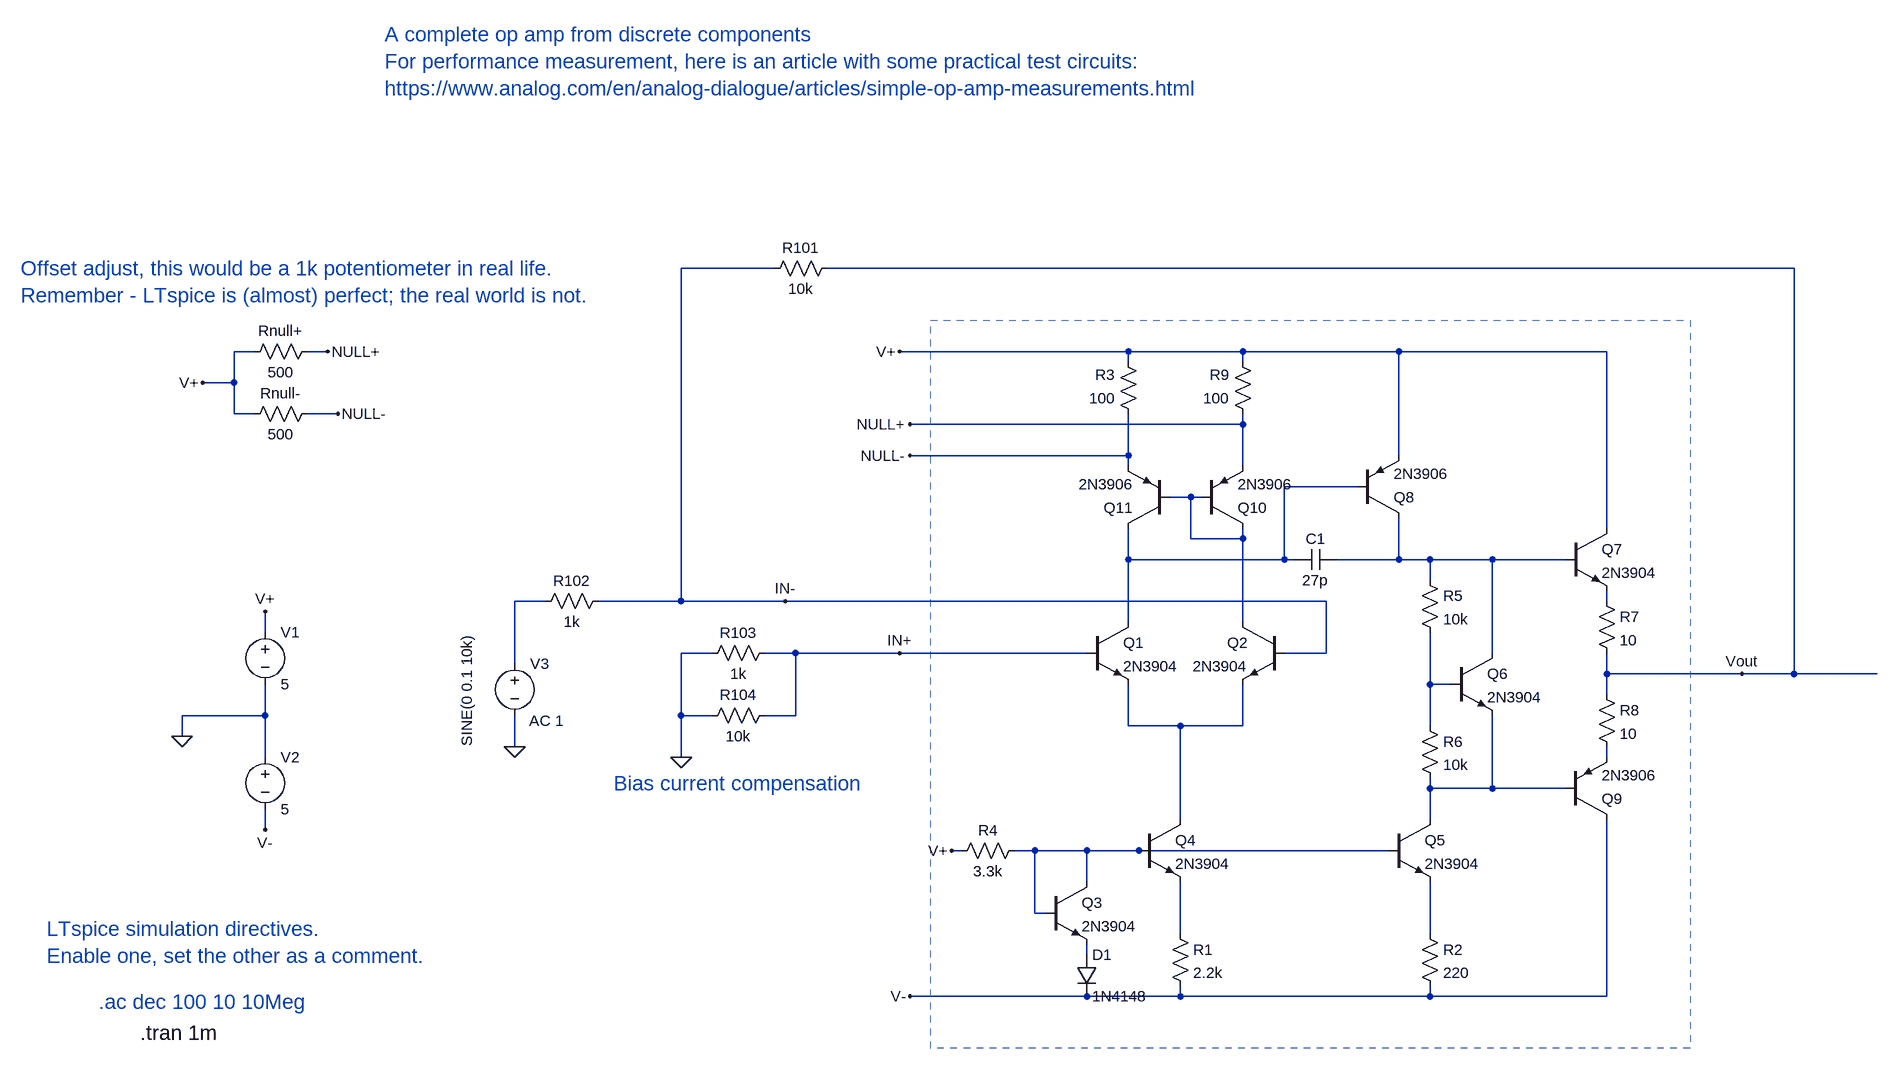
[diagram p0: schematic transistor_op_amp.asc]
transistor_op_amp.asc, the LTspice schematic file:
Version 4
SHEET 1 1432 756
WIRE -336 -448 -480 -448
WIRE 1232 -448 -256 -448
WIRE -1136 -320 -1168 -320
WIRE -1024 -320 -1056 -320
WIRE 208 -320 -144 -320
WIRE 384 -320 208 -320
WIRE 624 -320 384 -320
WIRE 944 -320 624 -320
WIRE 208 -304 208 -320
WIRE 384 -304 384 -320
WIRE -1168 -272 -1168 -320
WIRE -1168 -272 -1216 -272
WIRE -1168 -224 -1168 -272
WIRE -1136 -224 -1168 -224
WIRE -1008 -224 -1056 -224
WIRE 384 -208 384 -224
WIRE 384 -208 -128 -208
WIRE 208 -160 208 -224
WIRE 208 -160 -128 -160
WIRE 624 -160 624 -320
WIRE 208 -144 208 -160
WIRE 384 -144 384 -208
WIRE 560 -112 448 -112
WIRE 304 -96 272 -96
WIRE 320 -96 304 -96
WIRE 944 -48 944 -320
WIRE 304 -32 304 -96
WIRE 384 -32 384 -48
WIRE 384 -32 304 -32
WIRE 208 0 208 -48
WIRE 448 0 448 -112
WIRE 448 0 208 0
WIRE 464 0 448 0
WIRE 624 0 624 -64
WIRE 624 0 528 0
WIRE 672 0 624 0
WIRE 768 0 672 0
WIRE 880 0 768 0
WIRE 672 32 672 0
WIRE -688 64 -736 64
WIRE -480 64 -480 -448
WIRE -480 64 -608 64
WIRE -320 64 -480 64
WIRE 512 64 -320 64
WIRE 944 64 944 48
WIRE 208 96 208 0
WIRE 384 96 384 -32
WIRE -1120 112 -1120 80
WIRE -432 144 -480 144
WIRE -304 144 -352 144
WIRE -144 144 -304 144
WIRE 144 144 -144 144
WIRE 512 144 512 64
WIRE 512 144 448 144
WIRE 768 144 768 0
WIRE -736 160 -736 64
WIRE 944 176 944 144
WIRE 1152 176 944 176
WIRE 1232 176 1232 -448
WIRE 1232 176 1152 176
WIRE 1360 176 1232 176
WIRE 672 192 672 112
WIRE 704 192 672 192
WIRE 944 208 944 176
WIRE -1120 240 -1120 192
WIRE -1120 240 -1248 240
WIRE -480 240 -480 144
WIRE -432 240 -480 240
WIRE -304 240 -304 144
WIRE -304 240 -352 240
WIRE 208 256 208 192
WIRE 288 256 208 256
WIRE 384 256 384 192
WIRE 384 256 288 256
WIRE 672 256 672 192
WIRE -1248 272 -1248 240
WIRE -736 288 -736 240
WIRE -1120 304 -1120 240
WIRE -480 304 -480 240
WIRE 944 304 944 288
WIRE 672 352 672 336
WIRE 768 352 768 240
WIRE 768 352 672 352
WIRE 880 352 768 352
WIRE 288 400 288 256
WIRE 672 400 672 352
WIRE -1120 416 -1120 384
WIRE -48 448 -64 448
WIRE 64 448 32 448
WIRE 144 448 64 448
WIRE 224 448 144 448
WIRE 608 448 224 448
WIRE 144 496 144 448
WIRE 64 544 64 448
WIRE 80 544 64 544
WIRE 288 576 288 496
WIRE 672 576 672 496
WIRE 144 608 144 592
WIRE 144 672 -128 672
WIRE 288 672 288 656
WIRE 288 672 144 672
WIRE 672 672 672 656
WIRE 672 672 288 672
WIRE 944 672 944 400
WIRE 944 672 672 672
FLAG -480 304 0
FLAG -1248 272 0
FLAG -736 288 0
FLAG -144 -320 V+
FLAG -64 448 V+
FLAG -144 144 IN+
FLAG -320 64 IN-
FLAG -128 -160 NULL-
FLAG -1024 -320 NULL+
FLAG -1008 -224 NULL-
FLAG -1120 80 V+
FLAG -1120 416 V-
FLAG -128 672 V-
FLAG -1216 -272 V+
FLAG -128 -208 NULL+
FLAG 1152 176 Vout
SYMBOL npn 144 96 R0
SYMATTR InstName Q1
SYMATTR Value 2N3904
SYMBOL npn 448 96 M0
SYMATTR InstName Q2
SYMATTR Value 2N3904
SYMBOL pnp 272 -48 R180
SYMATTR InstName Q11
SYMATTR Value 2N3906
SYMBOL pnp 320 -48 M180
SYMATTR InstName Q10
SYMATTR Value 2N3906
SYMBOL pnp 560 -64 M180
SYMATTR InstName Q8
SYMATTR Value 2N3906
SYMBOL cap 528 -16 R90
WINDOW 0 0 32 VBottom 2
WINDOW 3 32 32 VTop 2
SYMATTR InstName C1
SYMATTR Value 27p
SYMBOL npn 880 -48 R0
SYMATTR InstName Q7
SYMATTR Value 2N3904
SYMBOL npn 704 144 R0
SYMATTR InstName Q6
SYMATTR Value 2N3904
SYMBOL pnp 880 400 M180
SYMATTR InstName Q9
SYMATTR Value 2N3906
SYMBOL res 928 48 R0
SYMATTR InstName R7
SYMATTR Value 10
SYMBOL res 928 192 R0
SYMATTR InstName R8
SYMATTR Value 10
SYMBOL res 656 16 R0
SYMATTR InstName R5
SYMATTR Value 10k
SYMBOL res 656 240 R0
SYMATTR InstName R6
SYMATTR Value 10k
SYMBOL npn 608 400 R0
SYMATTR InstName Q5
SYMATTR Value 2N3904
SYMBOL npn 224 400 R0
SYMATTR InstName Q4
SYMATTR Value 2N3904
SYMBOL npn 80 496 R0
SYMATTR InstName Q3
SYMATTR Value 2N3904
SYMBOL diode 128 608 R0
SYMATTR InstName D1
SYMATTR Value 1N4148
SYMBOL res -64 464 R270
WINDOW 0 32 56 VTop 2
WINDOW 3 0 56 VBottom 2
SYMATTR InstName R4
SYMATTR Value 3.3k
SYMBOL voltage -1120 96 R0
WINDOW 123 0 0 Left 2
WINDOW 39 0 0 Left 2
SYMATTR InstName V1
SYMATTR Value 5
SYMBOL voltage -1120 288 R0
WINDOW 123 0 0 Left 2
WINDOW 39 0 0 Left 2
SYMATTR InstName V2
SYMATTR Value 5
SYMBOL voltage -736 144 R0
WINDOW 123 22 104 Left 2
WINDOW 39 0 0 Left 2
WINDOW 3 -74 -28 VRight 2
SYMATTR Value2 AC 1
SYMATTR Value SINE(0 0.1 10k)
SYMATTR InstName V3
SYMBOL res -240 -464 R90
WINDOW 0 0 56 VBottom 2
WINDOW 3 32 56 VTop 2
SYMATTR InstName R101
SYMATTR Value 10k
SYMBOL res -704 80 R270
WINDOW 0 32 56 VTop 2
WINDOW 3 0 56 VBottom 2
SYMATTR InstName R102
SYMATTR Value 1k
SYMBOL res 272 560 R0
SYMATTR InstName R1
SYMATTR Value 2.2k
SYMBOL res 656 560 R0
SYMATTR InstName R2
SYMATTR Value 220
SYMBOL res -448 160 R270
WINDOW 0 32 56 VTop 2
WINDOW 3 0 56 VBottom 2
SYMATTR InstName R103
SYMATTR Value 1k
SYMBOL res -336 224 R90
WINDOW 0 0 56 VBottom 2
WINDOW 3 32 56 VTop 2
SYMATTR InstName R104
SYMATTR Value 10k
SYMBOL res 224 -208 R180
WINDOW 0 36 76 Left 2
WINDOW 3 36 40 Left 2
SYMATTR InstName R3
SYMATTR Value 100
SYMBOL res 400 -208 R180
WINDOW 0 36 76 Left 2
WINDOW 3 36 40 Left 2
SYMATTR InstName R9
SYMATTR Value 100
SYMBOL res -1152 -208 R270
WINDOW 0 32 56 VTop 2
WINDOW 3 0 56 VBottom 2
SYMATTR InstName Rnull-
SYMATTR Value 500
SYMBOL res -1040 -336 R90
WINDOW 0 0 56 VBottom 2
WINDOW 3 32 56 VTop 2
SYMATTR InstName Rnull+
SYMATTR Value 500
TEXT -1312 728 Left 3 !.tran 1m
TEXT -1376 680 Left 3 ;.ac dec 100 10 10Meg
TEXT -936 -808 Left 3 ;A complete op amp from discrete components\nFor performance measurement, here is an article with some practical test circuits:\nhttps://www.analog.com/en/analog-dialogue/articles/simple-op-amp-measurements.html
TEXT -1496 -448 Left 3 ;Offset adjust, this would be a 1k potentiometer in real life.\nRemember - LTspice is (almost) perfect; the real world is not.
TEXT -1456 568 Left 3 ;LTspice simulation directives.\nEnable one, set the other as a comment.
TEXT -584 344 Left 3 ;Bias current compensation
RECTANGLE Normal 1072 752 -96 -368 2

The netlist it stands for:
* transistor_op_amp.asc
Q1 N001 IN+ N007 0 2N3904
Q2 N002 IN- N007 0 2N3904
Q11 N001 N002 NULL- 0 2N3906
Q10 N002 N002 NULL+ 0 2N3906
Q8 N003 N001 V+ 0 2N3906
C1 N003 N001 27p
Q7 V+ N003 N005 0 2N3904
Q6 N003 N006 N009 0 2N3904
Q9 V- N009 N008 0 2N3906
R7 N005 Vout 10
R8 Vout N008 10
R5 N003 N006 10k
R6 N006 N009 10k
Q5 N009 N010 N012 0 2N3904
Q4 N007 N010 N011 0 2N3904
Q3 N010 N010 N013 0 2N3904
D1 N013 V- 1N4148
R4 V+ N010 3.3k
V1 V+ 0 5
V2 0 V- 5
V3 N004 0 SINE(0 0.1 10k) AC 1
R101 Vout IN- 10k
R102 N004 IN- 1k
R1 N011 V- 2.2k
R2 N012 V- 220
R103 0 IN+ 1k
R104 IN+ 0 10k
R3 NULL- V+ 100
R9 NULL+ V+ 100
Rnull- V+ NULL- 500
Rnull+ NULL+ V+ 500
.model D D
.lib standard.dio
.model NPN NPN
.model PNP PNP
.lib standard.bjt
.tran 1m
* .ac dec 100 10 10Meg
* A complete op amp from discrete components
* For performance measurement, here is an article with some practical test circuits:
* https://www.analog.com/en/analog-dialogue/articles/simple-op-amp-measurements.html
* Offset adjust, this would be a 1k potentiometer in real life.
* Remember - LTspice is (almost) perfect; the real world is not.
* LTspice simulation directives.
* Enable one, set the other as a comment.
* Bias current compensation
.backanno
.end